# Altium schematic sheet Pin-Filters.SchDoc
size A4
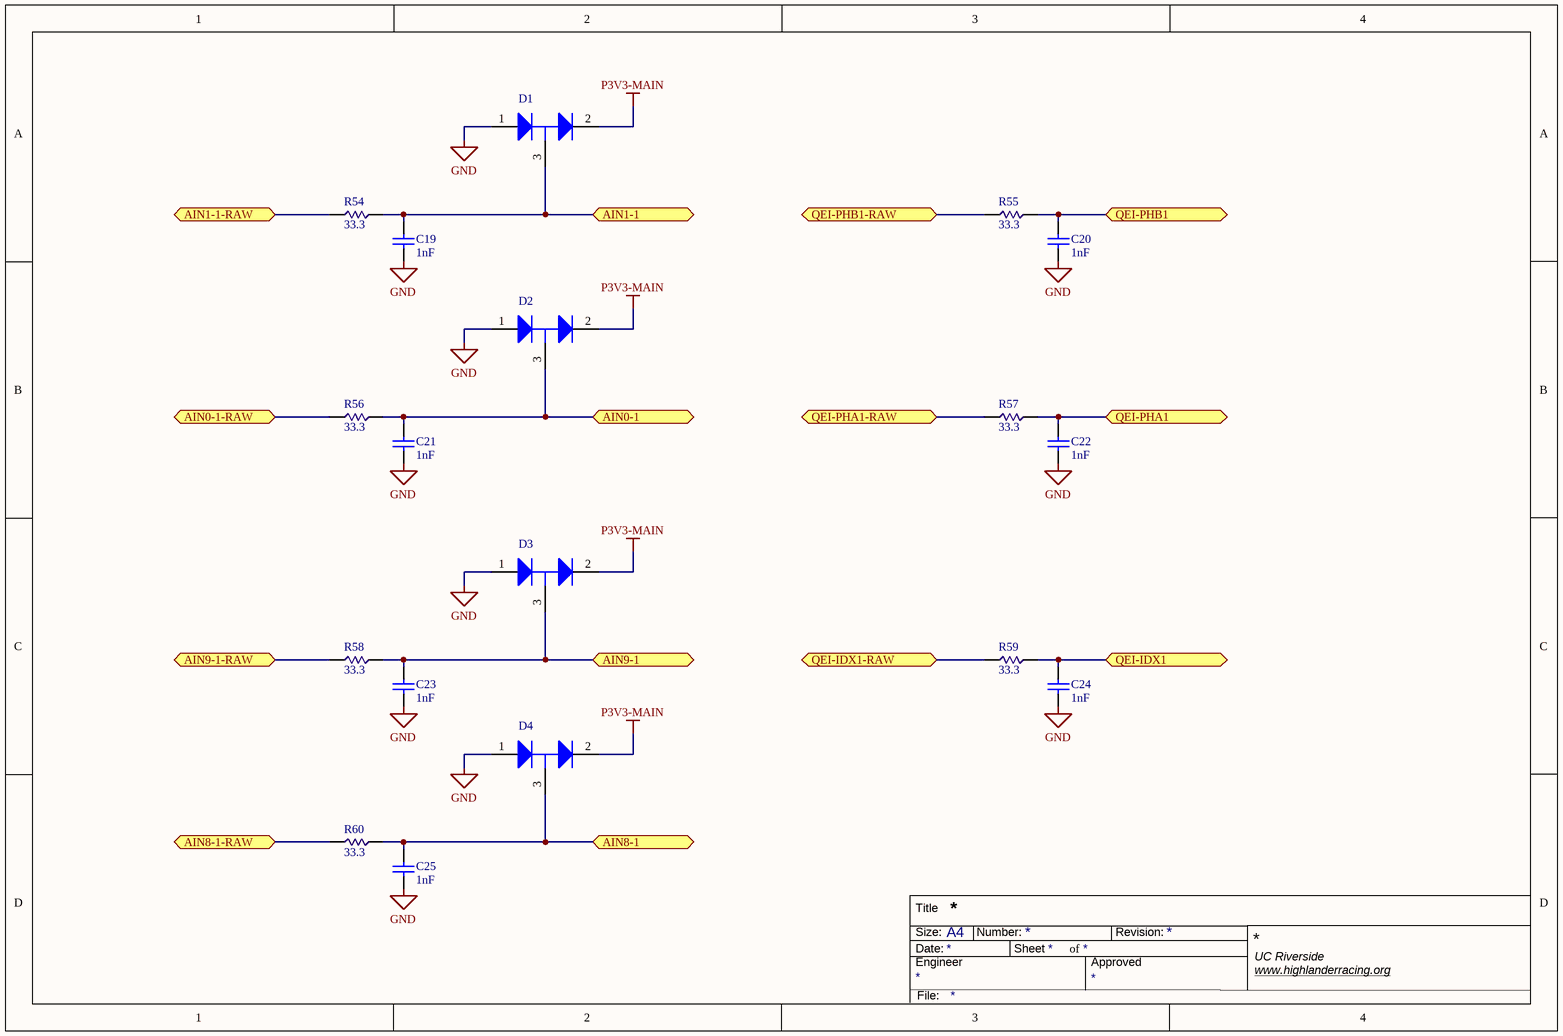
[diagram p0: Pin-Filters.SchDoc]

## Parts
C19  value 1nF  [FOOTPRINT-0805-GEN]  (hidden comment: Capacitor-Generic-0805)
C20  value 1nF  [FOOTPRINT-0805-GEN]  (hidden comment: Capacitor-Generic-0805)
C21  value 1nF  [FOOTPRINT-0805-GEN]  (hidden comment: Capacitor-Generic-0805)
C22  value 1nF  [FOOTPRINT-0805-GEN]  (hidden comment: Capacitor-Generic-0805)
C23  value 1nF  [FOOTPRINT-0805-GEN]  (hidden comment: Capacitor-Generic-0805)
C24  value 1nF  [FOOTPRINT-0805-GEN]  (hidden comment: Capacitor-Generic-0805)
C25  value 1nF  [FOOTPRINT-0805-GEN]  (hidden comment: Capacitor-Generic-0805)
D1  BAT54SLT1G  [FOOTPRINT-ONSC-SOT23-1A2KA3K]  (value not drawn)
D2  BAT54SLT1G  [FOOTPRINT-ONSC-SOT23-1A2KA3K]  (value not drawn)
D3  BAT54SLT1G  [FOOTPRINT-ONSC-SOT23-1A2KA3K]  (value not drawn)
D4  BAT54SLT1G  [FOOTPRINT-ONSC-SOT23-1A2KA3K]  (value not drawn)
R54  value 33.3  [FOOTPRINT-0805-GEN]  (hidden comment: SMC)
R55  value 33.3  [FOOTPRINT-0805-GEN]  (hidden comment: SMC)
R56  value 33.3  [FOOTPRINT-0805-GEN]  (hidden comment: SMC)
R57  value 33.3  [FOOTPRINT-0805-GEN]  (hidden comment: SMC)
R58  value 33.3  [FOOTPRINT-0805-GEN]  (hidden comment: SMC)
R59  value 33.3  [FOOTPRINT-0805-GEN]  (hidden comment: SMC)
R60  value 33.3  [FOOTPRINT-0805-GEN]  (hidden comment: SMC)

## Ports
AIN0-1 (bidir), AIN0-1-RAW (bidir), AIN1-1 (bidir), AIN1-1-RAW (bidir), AIN8-1 (bidir), AIN8-1-RAW (bidir), AIN9-1 (bidir), AIN9-1-RAW (bidir), QEI-IDX1 (bidir), QEI-IDX1-RAW (bidir), QEI-PHA1 (bidir), QEI-PHA1-RAW (bidir), QEI-PHB1 (bidir), QEI-PHB1-RAW (bidir)

## Nets
GND: C19.1 C20.1 C21.1 C22.1 C23.1 C24.1 C25.1 D1.1(A) D2.1(A) D3.1(A) D4.1(A)
P3V3-MAIN: D1.2(K) D2.2(K) D3.2(K) D4.2(K)
AIN0-1: C21.2 D2.3(K/A) R56.2 ; port AIN0-1
AIN0-1-RAW: R56.1 ; port AIN0-1-RAW
AIN1-1: C19.2 D1.3(K/A) R54.2 ; port AIN1-1
AIN1-1-RAW: R54.1 ; port AIN1-1-RAW
AIN8-1: C25.2 D4.3(K/A) R60.2 ; port AIN8-1
AIN8-1-RAW: R60.1 ; port AIN8-1-RAW
AIN9-1: C23.2 D3.3(K/A) R58.2 ; port AIN9-1
AIN9-1-RAW: R58.1 ; port AIN9-1-RAW
QEI-IDX1: C24.2 R59.2 ; port QEI-IDX1
QEI-IDX1-RAW: R59.1 ; port QEI-IDX1-RAW
QEI-PHA1: C22.2 R57.2 ; port QEI-PHA1
QEI-PHA1-RAW: R57.1 ; port QEI-PHA1-RAW
QEI-PHB1: C20.2 R55.2 ; port QEI-PHB1
QEI-PHB1-RAW: R55.1 ; port QEI-PHB1-RAW

## Notes on the sheet
- Title
- Size:
- Date:
- Engineer
- A4
- Number:
- Sheet
- of
- Approved
- Revision:
- UC Riverside
- www.highlanderracing.org <https://www.highlanderracing.org>
- File:

## Library data of the parts
C19-C25 = Capacitor-Generic-0805: Capacitor; Published: 8-Jun-2000; LatestRevisionDate: 17-Jul-2002; LatestRevisionNote: Re-released for DXP Platform.; PackageReference: RAD-0.3; Publisher: Altium Limited; PackageDescription: Radial Cap, Thru-Hole; 2 Leads; 0.3 in Pin Spacing
D1-D4 = Diode-ONSC-BAT54S: Dual Series Schottky Barrier Diodes, 3-Pin SOT-23, Pb-Free, Tape and Reel; Manufacturer: On Semiconductor; IFSM Max (A): 0.6; trr Max (ns): 5; DatasheetVersion: Rev. 15; ComponentLink3Description: Package Specification; ComponentLink1URL: http://www.onsemi.com/; ComponentLink1Description: Manufacturer URL; PackageDescription: 3-Pin Small Outline Transistor, Body 2.92 x 1.3 mm, Pitch 0.95 mm; Configuration: Dual; ComponentLink2Description: Datasheet; RoHS: TRUE; ComponentLink3URL: http://www.onsemi.cn/pub_link/Collateral/318-08.PDF; PackageVersion: Rev. AP, 11/2009; Packing: Tape and Reel; PartNumber: BAT54SLT1G; PackageReference: SOT-23-3-318-08; ComponentLink2URL: http://www.onsemi.cn/pub_link/Collateral/BAT54SLT1-D.PDF; Mounting Technology: Surface Mount
R54-R60 = Resistor-Generic-0805-2012: 1/8 Watt Surface Mount Resistor